# Altium schematic sheet 原理图.SchDoc
size A4
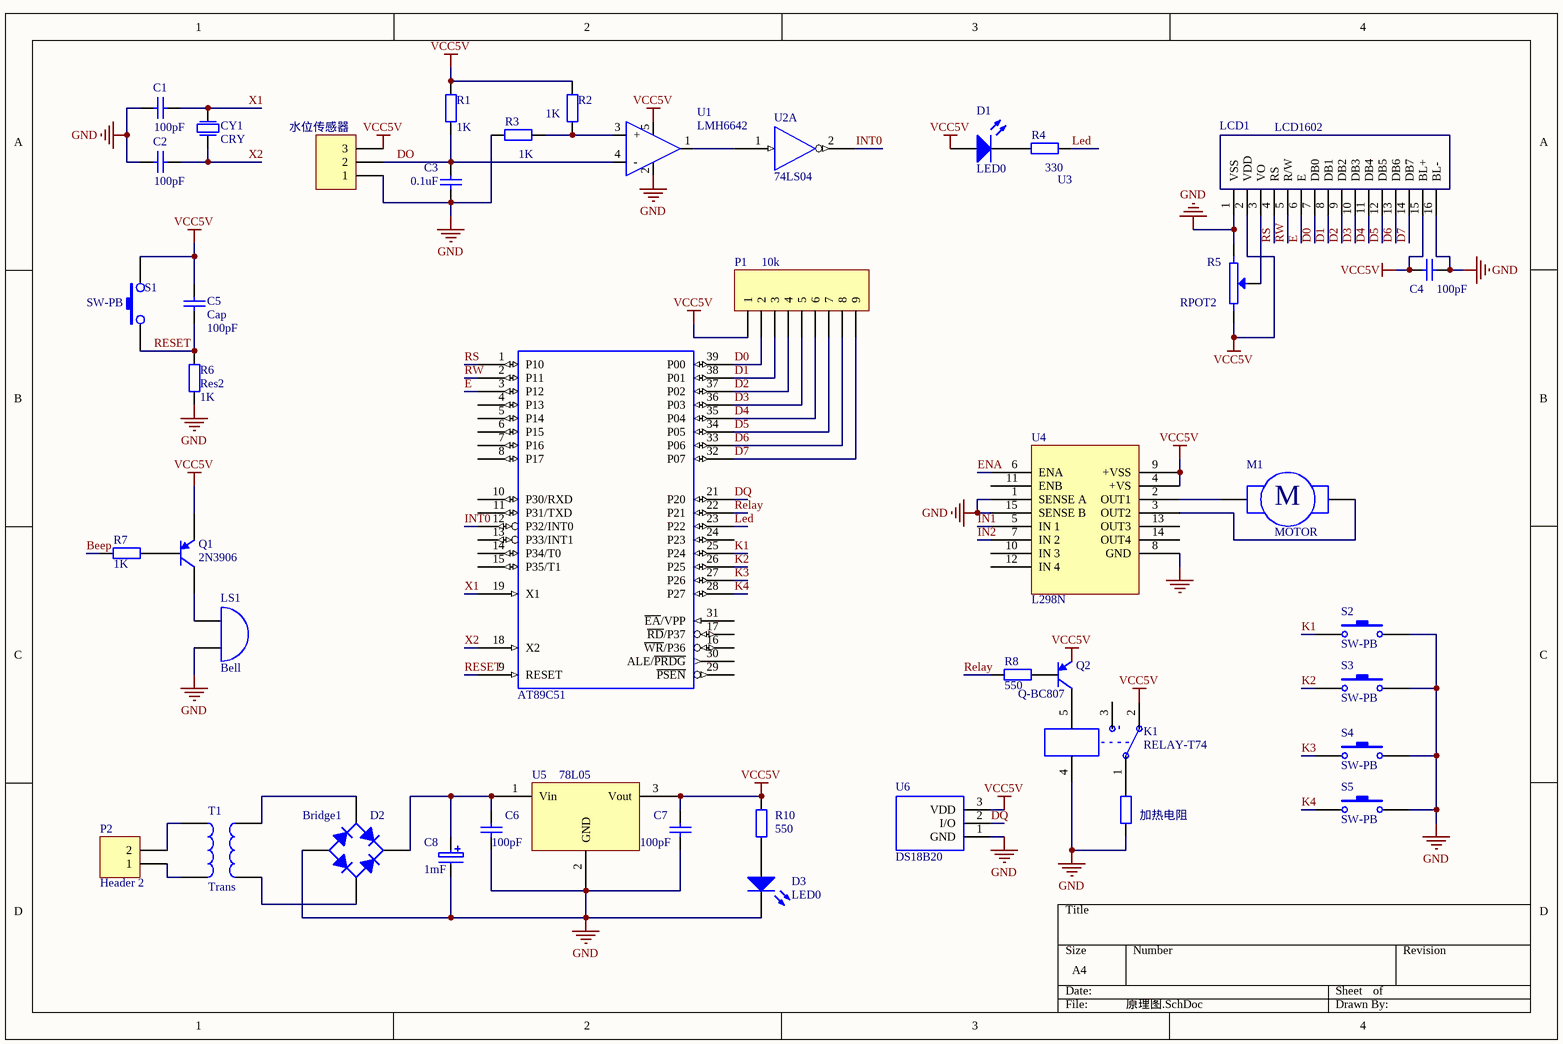
[diagram p0: 原理图.SchDoc]

## Parts
C1  value 100pF  [RAD-0.3]  (hidden comment: Cap)
C2  value 100pF  [RAD-0.3]  (hidden comment: Cap)
C3  value 0.1uF  [RAD-0.3]  (hidden comment: Cap)
C4  value 100pF  [RAD-0.3]  (hidden comment: Cap)
C5  Cap  value 100pF  [RAD-0.3]
C6  value 100pF  [RAD-0.3]  (hidden comment: Cap)
C7  value 100pF  [RAD-0.3]  (hidden comment: Cap)
C8  1mF  [RB1]
CY1  CRY  [XTAL-1]
D1  LED0  [LED-0]
D2  Bridge1  [D-38]
D3  LED0  [LED-0]
K1  RELAY-T74  [RELAY-T74]
LCD1  LCD1602  [LCD1602]
LS1  Bell  [PIN2]
M1  MOTOR  [DG1282]
P1  10k  [MHDR1X9]
P2  Header 2  [HDR1X2]
Q1  2N3906  [TO-92A]
Q2  Q-BC807  [SOT-23Q]
R1  value 1K  [AXIAL-0.4]  (hidden comment: Res2)
R2  value 1K  [AXIAL-0.4]  (hidden comment: Res2)
R3  value 1K  [AXIAL-0.4]  (hidden comment: Res2)
R4  value 330  [AXIAL-0.4]  (hidden comment: Res2)
R5  RPOT2  [VR5]
R6  Res2  value 1K  [AXIAL-0.4]
R7  value 1K  [AXIAL-0.4]  (hidden comment: Res2)
R8  value 550  [AXIAL-0.4]  (hidden comment: Res2)
R10  value 550  [AXIAL-0.4]  (hidden comment: Res2)
S1  SW-PB
S2  SW-PB  [SPST-2]
S3  SW-PB  [SPST-2]
S4  SW-PB  [SPST-2]
S5  SW-PB  [SPST-2]
T1  Trans  [TRANS]
U1  LMH6642
U2  74LS04  [DIP-14]  (part A of 6)
U3  AT89C51  [DIP-40]
U4  L298N  [L298N散热片]
U5  78L05  [TO257V]
U6  DS18B20  [TO-92A]
加热电阻  Res2  [AXIAL-0.4]  (value not drawn)
水位传感器  Header 3H  [HDR1X3H]  (value not drawn)

## Nets
GND: C1.1 C2.1 C3.1 C4.1 C6.1 C7.1 C8.2 D2.3(A) D3.2(K) K1.4 LCD1.1(VSS) LCD1.16(BL-) LS1.2(B) R3.2 R5.3 R6.1 S2.2 S3.2 S4.2 S5.2 U1.2(V-) U2.7(GND) U3.20(GND) U4.1(SENSE_A) U4.8(GND) U4.15(SENSE_B) U5.2(GND) U6.1(GND) 加热电阻.1 水位传感器.1
VCC: U2.14(VCC) U3.40(VCC)
VCC5V: C4.2 C5.2 C7.2 D1.1(A) K1.2 LCD1.2(VDD) LCD1.15(BL+) P1.1 Q1.1(E) R1.2 R2.2 R5.1 R10.2 S1.2 U1.5(V+) U4.4(+VS) U4.9(+VSS) U5.3(Vout) U6.3(VDD) 水位传感器.3
Beep: R7.2
D0: LCD1.7(DB0) P1.2 U3.39(P00)
D1: LCD1.8(DB1) P1.3 U3.38(P01)
D2: LCD1.9(DB2) P1.4 U3.37(P02)
D3: LCD1.10(DB3) P1.5 U3.36(P03)
D4: LCD1.11(DB4) P1.6 U3.35(P04)
D5: LCD1.12(DB5) P1.7 U3.34(P05)
D6: LCD1.13(DB6) P1.8 U3.33(P06)
D7: LCD1.14(DB7) P1.9 U3.32(P07)
DO: C3.2 R1.1 U1.4(-) 水位传感器.2
DQ: U3.21(P20) U6.2(I/O)
E: LCD1.6(E) U3.3(P12)
ENA: U4.6(ENA)
IN1: U4.5(IN_1)
IN2: U4.7(IN_2)
INT0: U2.2 U3.12(P32/INT0)
K1: S2.1 U3.25(P24)
K2: S3.1 U3.26(P25)
K3: S4.1 U3.27(P26)
K4: S5.1 U3.28(P27)
Led: R4.1 U3.23(P22)
Relay: R8.2 U3.22(P21)
RESET: C5.1 R6.2 S1.1 U3.9(RESET)
RS: LCD1.4(RS) U3.1(P10)
RW: LCD1.5(R/W) U3.2(P11)
X1: C1.2 CY1.1(P1) U3.19(X1)
X2: C2.2 CY1.2(P2) U3.18(X2)
NetC6_2: C6.2 C8.1 D2.1(K) U5.1(Vin)
NetD1_2: D1.2(K) R4.2
NetD2_2: D2.2(C) T1.4
NetD2_4: D2.4(C) T1.3
NetD3_1: D3.1(A) R10.1
NetK1_1: K1.1 加热电阻.2
NetK1_5: K1.5 Q2.C
NetLCD1_3: LCD1.3(VO) R5.2(VT)
NetLS1_1: LS1.1(A) Q1.3(C)
NetM1_1: M1.1 U4.3(OUT2)
NetM1_2: M1.2 U4.2(OUT1)
NetP2_1: P2.1 T1.2
NetP2_2: P2.2 T1.1
NetQ1_2: Q1.2(B) R7.1
NetQ2_B: Q2.B R8.1
NetR2_1: R2.1 R3.1 U1.3(+)
NetU1_1: U1.1(OUT) U2.1

Not connected (* = marked no-connect by the designer): K1 3; Q2 E; U3 4(P13) 5(P14) 6(P15) 7(P16) 8(P17) 10(P30/RXD) 11(P31/TXD) 13(P33/INT1) 14(P34/T0) 15(P35/T1) 16(~{WR}/P36) 17(~{RD}/P37) 24(P23) 29(~{PSEN}) 30(ALE/~{PRDG}) 31(~{EA}/VPP); U4 10(IN_3) 11(ENB) 12(IN_4) 13(OUT3) 14(OUT4)

## Notes on the sheet
- Labels drawn without touching a wire or pin: VCC5V
- (in symbol MOTOR) M

## Library data of the parts
C1-C7 = Cap: Capacitor; Published: 8-Jun-2000; LatestRevisionDate: 17-Jul-2002; LatestRevisionNote: Re-released for DXP Platform.; PackageReference: RAD-0.3; Publisher: Altium Limited; PackageDescription: Radial Cap, Thru-Hole; 2 Leads; 0.3 in Pin Spacing
C8 = CAP3
D1 D3 = LED0: Typical INFRARED GaAs LED; Published: 8-Jun-2000; LatestRevisionDate: 08-Jul-2005; LatestRevisionNote: Mech Layer 1 removed.; PackageReference: LED-0; Publisher: Altium Limited; PackageDescription: LED; 2 Leads
D2 = Bridge1: Full Wave Diode Bridge; Published: 8-Jun-2000; LatestRevisionDate: 29-May-2009; LatestRevisionNote: Sch pins A & K swapped.; DatasheetVersion: E2732B; PackageReference: D-38; Publisher: Altium Limited; PackageDescription: Bridge Rectifier; 4 Terminals; Body 9.4 x 9.4 mm (typ); Pitch 5.08 mm
K1 = RELAY-T74: CN-RELAY-T74
LS1 = Bell: Electrical Bell; Published: 24-Mar-1999; LatestRevisionDate: 17-Jul-2002; LatestRevisionNote: Re-released for DXP Platform.; PackageReference: PIN2; Publisher: Altium Limited
P1 = MHDR1X9: Header, 9-Pin; LatestRevisionDate: 17-Jul-2002; LatestRevisionNote: Re-released for DXP Platform.; Publisher: Altium Limited
P2 = Header 2: Header, 2-Pin; LatestRevisionDate: 17-Jul-2002; LatestRevisionNote: Re-released for DXP Platform.; Publisher: Altium Limited
Q1 = 2N3906: PNP General Purpose Amplifier; Published: 8-Jun-2000; LatestRevisionDate: 15-Jan-2003; LatestRevisionNote: PCB Footprint 'BCY-W3/D4.7' replaced; DatasheetVersion: 1997; PackageVersion: Sep-1998; PackageReference: TO-92A; Publisher: Altium Limited; PackageDescription: TO, Flat Index; 3 In-Line, Axial Leads; Body Dia. 4.5mm; Leads 0.51 x 0.48 mm (max); ComponentLink1Description: Manufacturer Link; ComponentLink1URL: http://www.fairchildsemi.com/; ComponentLink2Description: Datasheet; ComponentLink2URL: http://www.fairchildsemi.com/ds/2N%2F2N3906.pdf
Q2 = Q-BC807: PNP General Purpose Amplifier; Published: 8-Jun-2000; LatestRevisionDate: 15-Jan-2003; LatestRevisionNote: PCB Footprint 'BCY-W3/D4.7' replaced; DatasheetDocument: 1997; PackageDocument: Sep-1998; PackageReference: TO-92A; Publisher: Altium Limited; Code_JEDEC: TO-92A; ComponentLink1Description: Manufacturer Link; ComponentLink1URL: http://www.fairchildsemi.com/; ComponentLink2Description: Datasheet; ComponentLink2URL: http://www.fairchildsemi.com/ds/2N%2F2N3906.pdf
R1-R4 R6-R8 R10 = Res2: Resistor; Published: 8-Jun-2000; LatestRevisionDate: 17-Jul-2002; LatestRevisionNote: Re-released for DXP Platform.; PackageReference: AXIAL-0.4; Publisher: Altium Limited; PackageDescription: Axial Device, Thru-Hole; 2 Leads; 0.4 in Pin Spacing
R5 = RPOT2: Potentiometer
S2-S5 = SW-PB: Switch; Published: 24-Mar-1999; LatestRevisionDate: 17-Jul-2002; LatestRevisionNote: Re-released for DXP Platform.; PackageReference: SPST-2; Publisher: Altium Limited
T1 = Trans: Transformer; Published: 24-Mar-1999; LatestRevisionDate: 08-Jul-2005; LatestRevisionNote: Mech Layer 1 removed.; PackageReference: TRANS; Publisher: Altium Limited; PackageDescription: Transformer; 4 Leads
U1 = LMH6642: Amplifier IC
U5 = 78**
加热电阻 = Res2: Resistor; Value: 550; Published: 8-Jun-2000; LatestRevisionDate: 17-Jul-2002; LatestRevisionNote: Re-released for DXP Platform.; PackageReference: AXIAL-0.4; Publisher: Altium Limited; PackageDescription: Axial Device, Thru-Hole; 2 Leads; 0.4 in Pin Spacing
水位传感器 = Header 3H: Header, 3-Pin, Right Angle; LatestRevisionDate: 17-Jul-2002; LatestRevisionNote: Re-released for DXP Platform.; Publisher: Altium Limited